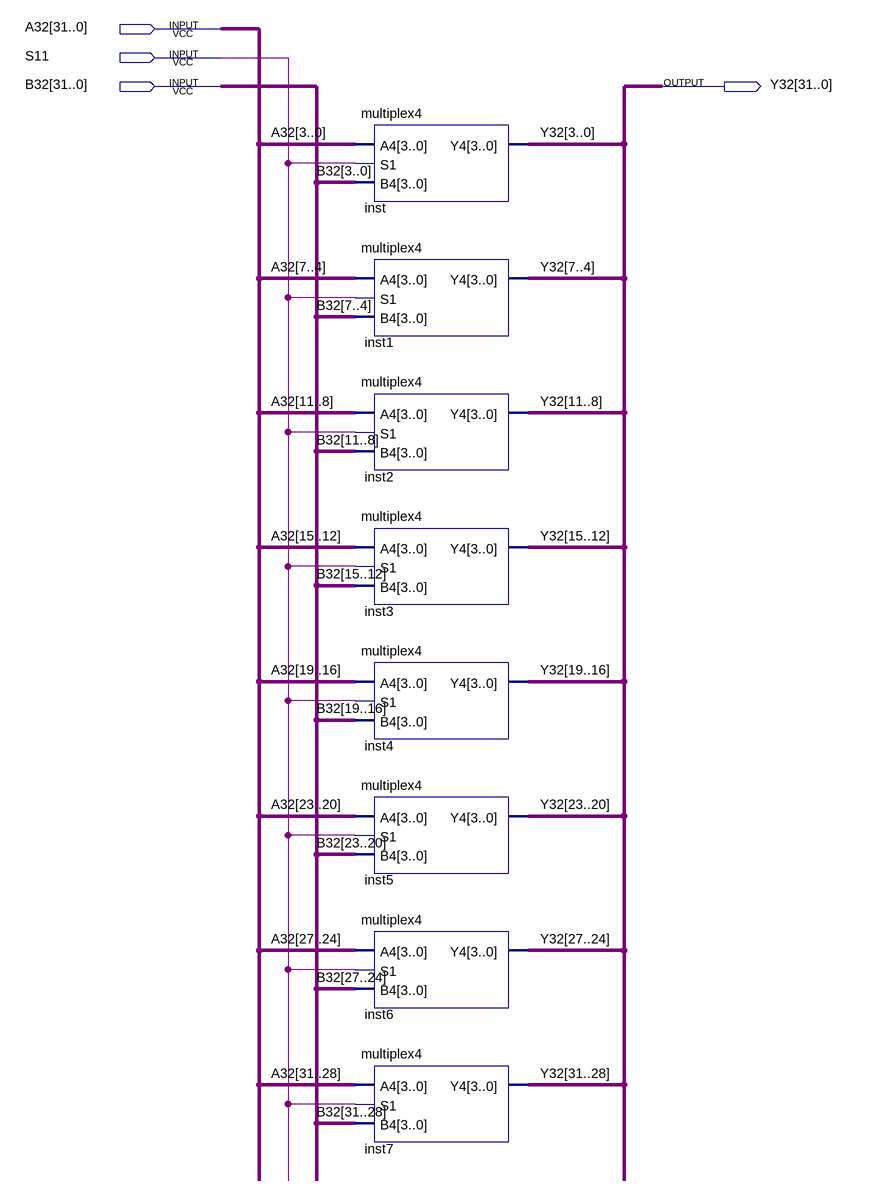
[diagram p0: schematic sheet]
// Quartus schematic multiplex32.bdf as structural Verilog: 8 symbols, 4 pins
module multiplex32 (
  input  [31:0] A32,
  input  S11,
  input  [31:0] B32,
  output [31:0] Y32
);

  multiplex4 inst (.A4(A32[3:0]), .S1(S11), .B4(B32[3:0]), .Y4(Y32[3:0]));
  multiplex4 inst1 (.A4(A32[7:4]), .S1(S11), .B4(B32[7:4]), .Y4(Y32[7:4]));
  multiplex4 inst2 (.A4(A32[11:8]), .S1(S11), .B4(B32[11:8]), .Y4(Y32[11:8]));
  multiplex4 inst3 (.A4(A32[15:12]), .S1(S11), .B4(B32[15:12]), .Y4(Y32[15:12]));
  multiplex4 inst4 (.A4(A32[19:16]), .S1(S11), .B4(B32[19:16]), .Y4(Y32[19:16]));
  multiplex4 inst5 (.A4(A32[23:20]), .S1(S11), .B4(B32[23:20]), .Y4(Y32[23:20]));
  multiplex4 inst6 (.A4(A32[27:24]), .S1(S11), .B4(B32[27:24]), .Y4(Y32[27:24]));
  multiplex4 inst7 (.A4(A32[31:28]), .S1(S11), .B4(B32[31:28]), .Y4(Y32[31:28]));
endmodule
